# Altium schematic sheet Sheet2.SchDoc
size A4
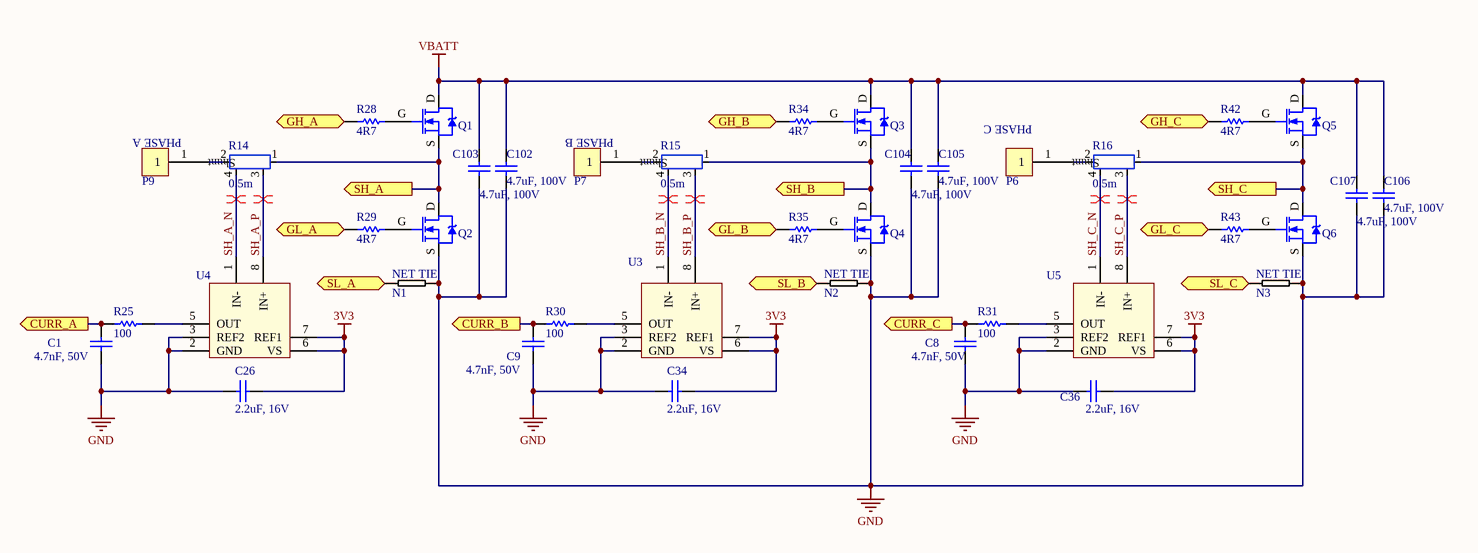
[diagram p0: Sheet2.SchDoc]

## Parts
C1  value 4.7nF, 50V  [SMD-0603 Capacitor]  (hidden comment: CAP)
C8  value 4.7nF, 50V  [SMD-0603 Capacitor]  (hidden comment: CAP)
C9  value 4.7nF, 50V  [SMD-0603 Capacitor]  (hidden comment: CAP)
C26  value 2.2uF, 16V  [SMD-0603 Capacitor]  (hidden comment: Voltage important)
C34  value 2.2uF, 16V  [SMD-0603 Capacitor]  (hidden comment: Voltage important)
C36  value 2.2uF, 16V  [SMD-0603 Capacitor]  (hidden comment: Voltage important)
C102  value 4.7uF, 100V  [SMD-1206 Capacitor]  (hidden comment: CAP)
C103  value 4.7uF, 100V  [SMD-1206 Capacitor]  (hidden comment: CAP)
C104  value 4.7uF, 100V  [SMD-1206 Capacitor]  (hidden comment: CAP)
C105  value 4.7uF, 100V  [SMD-1206 Capacitor]  (hidden comment: CAP)
C106  value 4.7uF, 100V  [SMD-1206 Capacitor]  (hidden comment: CAP)
C107  value 4.7uF, 100V  [SMD-1206 Capacitor]  (hidden comment: CAP)
N1  -  [NET TIE 12MM VIA]  (value not drawn)  (net tie, no BOM)
N2  -  [NET TIE 12MM VIA]  (value not drawn)  (net tie, no BOM)
N3  -  [NET TIE 12MM VIA]  (value not drawn)  (net tie, no BOM)
P6  -  [PAD1]  (value not drawn)
P7  -  [PAD1]  (value not drawn)
P9  -  [PAD1]  (value not drawn)
Q1  MOSFET_N  [DIRECTFET_1]  (value not drawn)
Q2  MOSFET_N  [DIRECTFET_1]  (value not drawn)
Q3  MOSFET_N  [DIRECTFET_1]  (value not drawn)
Q4  MOSFET_N  [DIRECTFET_1]  (value not drawn)
Q5  MOSFET_N  [DIRECTFET_1]  (value not drawn)
Q6  MOSFET_N  [DIRECTFET_1]  (value not drawn)
R14  0.5m  [2512 Shunt]
R15  0.5m  [2512 Shunt]
R16  0.5m  [2512 Shunt]
R25  100  [SMD-0603 Resistor]
R28  4R7  [SMD-0603 Resistor]
R29  4R7  [SMD-0603 Resistor]
R30  100  [SMD-0603 Resistor]
R31  100  [SMD-0603 Resistor]
R34  4R7  [SMD-0603 Resistor]
R35  4R7  [SMD-0603 Resistor]
R42  4R7  [SMD-0603 Resistor]
R43  4R7  [SMD-0603 Resistor]
U3  AD8418  [MSOP-8]  (value not drawn)
U4  AD8418  [MSOP-8]  (value not drawn)
U5  AD8418  [MSOP-8]  (value not drawn)

## Ports
CURR_A (out), CURR_B (out), CURR_C (out), GH_A (in), GH_B (in), GH_C (in), GL_A (in), GL_B (in), GL_C (in), SH_A (out), SH_B (out), SH_C (out), SL_A (out), SL_B (out), SL_C (out)

## Nets
3V3: C26.2 C34.2 C36.2 U3.6(VS) U3.7(REF1) U4.6(VS) U4.7(REF1) U5.6(VS) U5.7(REF1)
GND: C1.1 C8.1 C9.1 C26.1 C34.1 C36.1 C102.2 C103.2 C104.1 C105.1 C106.2 C107.2 N1.2 N2.2 N3.2 Q2.S Q4.S Q6.S U3.2(GND) U3.3(REF2) U4.2(GND) U4.3(REF2) U5.2(GND) U5.3(REF2)
VBATT: C102.1 C103.1 C104.2 C105.2 C106.1 C107.1 Q1.D Q3.D Q5.D
CURR_A: C1.2 R25.1 ; port CURR_A
CURR_B: C9.2 R30.1 ; port CURR_B
CURR_C: C8.2 R31.1 ; port CURR_C
GH_A: R28.1 ; port GH_A
GH_B: R34.1 ; port GH_B
GH_C: R42.1 ; port GH_C
GL_A: R29.1 ; port GL_A
GL_B: R35.1 ; port GL_B
GL_C: R43.1 ; port GL_C
SH_A: Q1.S Q2.D R14.1 ; port SH_A
SH_A_N: R14.4 U4.1(IN-)
SH_A_P: R14.3 U4.8(IN+)
SH_B: Q3.S Q4.D R15.1 ; port SH_B
SH_B_N: R15.4 U3.1(IN-)
SH_B_P: R15.3 U3.8(IN+)
SH_C: Q5.S Q6.D R16.1 ; port SH_C
SH_C_N: R16.4 U5.1(IN-)
SH_C_P: R16.3 U5.8(IN+)
SL_A: N1.1 ; port SL_A
SL_B: N2.1 ; port SL_B
SL_C: N3.1 ; port SL_C
NetP6_1: P6.1 R16.2
NetP7_1: P7.1 R15.2
NetP9_1: P9.1 R14.2
NetQ1_G: Q1.G R28.2
NetQ2_G: Q2.G R29.2
NetQ3_G: Q3.G R34.2
NetQ4_G: Q4.G R35.2
NetQ5_G: Q5.G R42.2
NetQ6_G: Q6.G R43.2
NetR25_2: R25.2 U4.5(OUT)
NetR30_2: R30.2 U3.5(OUT)
NetR31_2: R31.2 U5.5(OUT)

## Layout directives
differential pair: SH_A_N, SH_A_P, SH_B_N, SH_B_P, SH_C_N, SH_C_P

## Notes on the sheet
- (near P9) PHASE A
- (near P7) PHASE B
- (near P6) PHASE C
- Title
- Size:
- Date:
- A4
- Number:
- Time:
- Revision:
- Sheet
- of
- File:
- (in symbol 3) NET TIE
- (in symbol 28) Shunt

## Library data of the parts
C1 C8 C9 = 1: CAP 4.7n, 50V, 0603; Manufacturer Part Number: GRM39X472J50D; Manufacturer: Murata Electronics North America; ID: 1; Place (YES/NO): YES
C26 C34 C36 = 9: CAP 2.2u, 16V, 0603; Manufacturer Part Number: C1608X5R1C225M; Manufacturer: TDK Corporation; ID: 9; Place (YES/NO): YES
C102-C107 = 23: 4.7µF 100V Ceramic Capacitor X7S 1206; Manufacturer Part Number: 12061Z475MAT2A; Manufacturer: AVX Corporation; ID: 23; Place (YES/NO): YES
N1-N3 = 3: ID: 3; Value: -; Place (YES/NO): -; Manufacturer Part Number: -; Manufacturer: -
P6 P7 P9 = 1: SMD Power landing; ID: 1; Value: -; Place (YES/NO): -; Manufacturer Part Number: -; Manufacturer: -
Q1-Q6 = 10: MOSFET N-CH 60V 200A DIRECTFETL8; Manufacturer Part Number: IRF7749L1TRPBF; Manufacturer: Infineon Technologies Americas Corp; ID: 10; Place (YES/NO): YES
R14-R16 = 28: RES SMD 500 UOHM 1% 6W 2512; Manufacturer Part Number: CSS2H-2512R-L500FE; Manufacturer: Bourn; ID: 28; Place (YES/NO): YES; Value: 0.5m
R25 R30 R31 = 2: R 100ohm, 0603; Manufacturer Part Number: RK73H1JTTD1000F; Manufacturer: KOA Speer; ID: 2; Place (YES/NO): YES; Value: 100
R28 R29 R34 R35 R42 R43 = 1: R 4.7ohm, 0603; Manufacturer Part Number: RK73H1JTTD4R70F; Manufacturer: KOA Speer; ID: 1; Place (YES/NO): YES; Value: 4R7
U3-U5 = 19: IC OPAMP CURR SENSE 8MSOP; Manufacturer Part Number: AD8418AWHRMZ; Manufacturer: Analog Devices Inc.; ID: 19; Value: Current Sense; Place (YES/NO): YES